# Altium project PLC_STM.PrjPcb
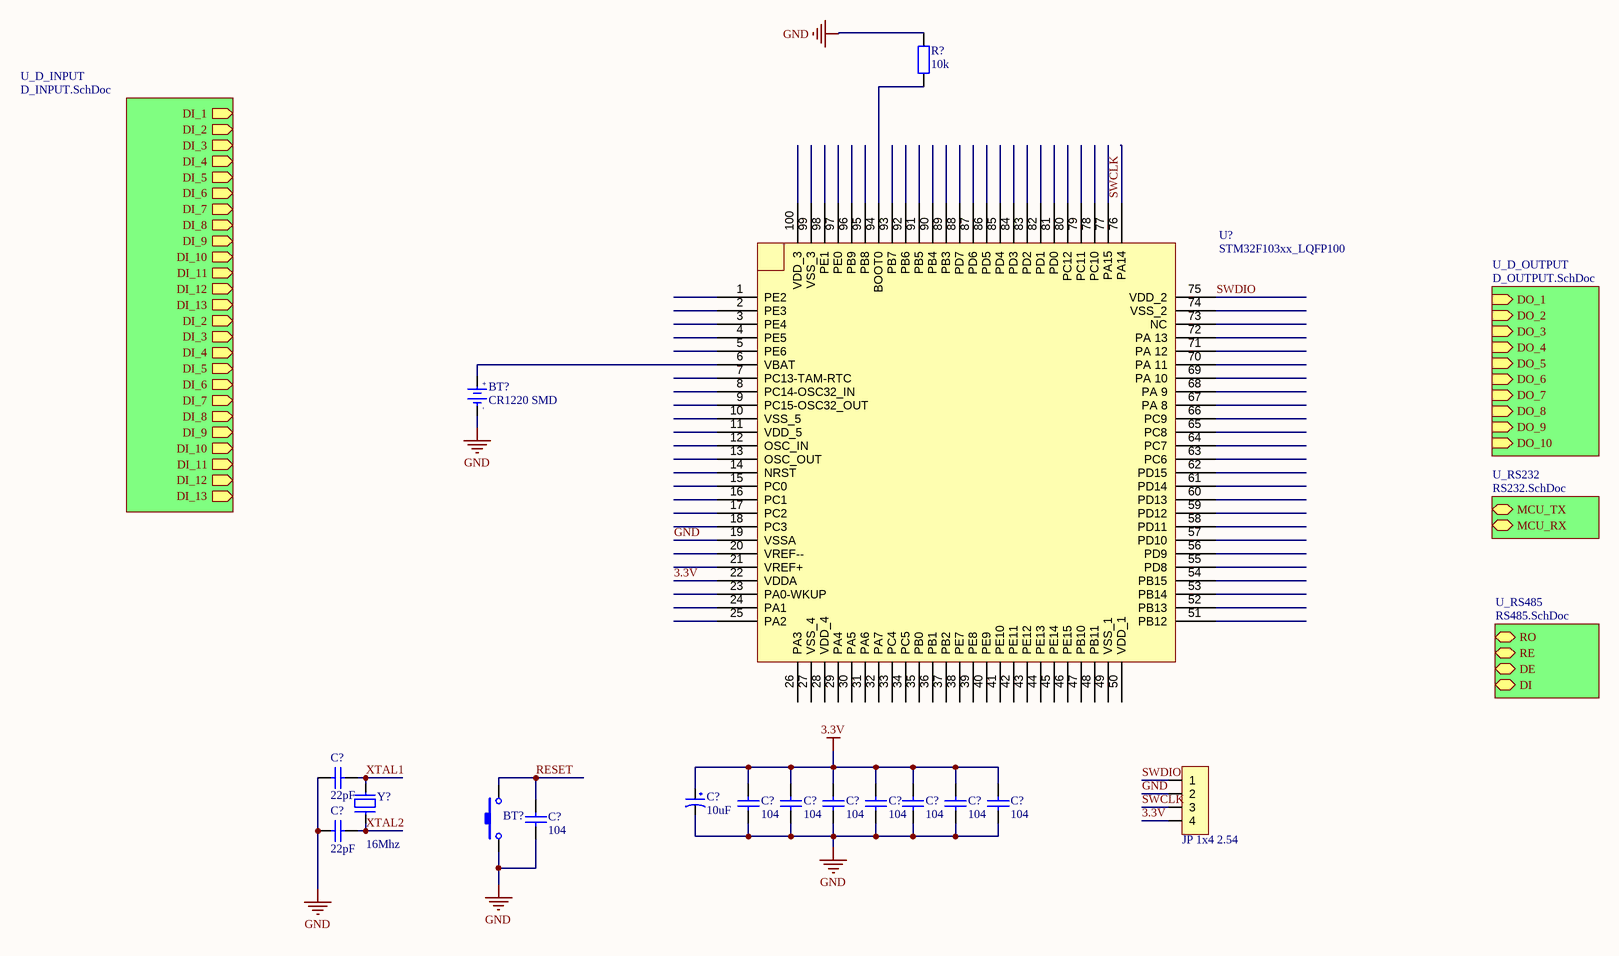
[diagram p0: PLC_STM_SCH.SchDoc]
5 sheets, 100 parts. Net scope: hierarchical (ports join the sheet entries above them; power ports are global).
Board file: PLC_STM_PCB.PcbDoc
Sheets:
  PLC_STM_SCH.SchDoc
    U_D_INPUT = D_INPUT.SchDoc
    U_D_OUTPUT = D_OUTPUT.SchDoc
  A_INPUT.SchDoc
  PWM_OUTPUT.SchDoc

## Sheet PLC_STM_SCH.SchDoc
size 420 x 297 mm; SheetNumber: 1; SheetTotal: 7

### Parts
(Parts that share a designator on the sheet are numbered #1, #2 ... from top to bottom, then left to right.)
BT?#1  CR1220 SMD  [DE PIN CR1220]
BT?#2  Nut Nhan 2 Chan SMD 3x6x2.5  [Nut Nhan 2 Chan SMD 3x6x2.5]  (value not drawn)
C?#1  22pF  [tu 0805]
C?#2  10uF  [tu tantalum smd3216]
C?#3  104  [tu 0805]
C?#4  104  [tu 0805]
C?#5  104  [tu 0805]
C?#6  104  [tu 0805]
C?#7  104  [tu 0805]
C?#8  104  [tu 0805]
C?#9  104  [tu 0805]
C?#10  104  [tu 0805]
C?#11  22pF  [tu 0805]
JP?  JP 1x4 2.54  [JP 1x4 DT]
R?#1  10k  [tro smd 0805]
U?#1  STM32F103xx_LQFP100  [STM32_LQFP100]
Y?  16Mhz  [Thach Anh 2 chan SMD]

### Sub-sheets
U_D_INPUT = D_INPUT.SchDoc: DI_1 (out), DI_2 (out), DI_3 (out), DI_4 (out), DI_5 (out), DI_6 (out), DI_7 (out), DI_8 (out), DI_9 (out), DI_10 (out), DI_11 (out), DI_12 (out), DI_13 (out), DI_2 (out), DI_3 (out), DI_4 (out), DI_5 (out), DI_6 (out), DI_7 (out), DI_8 (out), DI_9 (out), DI_10 (out), DI_11 (out), DI_12 (out), DI_13 (out)
U_D_OUTPUT = D_OUTPUT.SchDoc: DO_1 (in), DO_2 (in), DO_3 (in), DO_4 (in), DO_5 (in), DO_6 (in), DO_7 (in), DO_8 (in), DO_9 (in), DO_10 (in)
U_RS232 = RS232.SchDoc (file not in this document): MCU_TX (bidir), MCU_RX (bidir)
U_RS485 = RS485.SchDoc (file not in this document): RO (bidir), RE (bidir), DE (bidir), DI (bidir)

### Nets
3.3V: C?#2.1 C?#3.1 C?#4.1 C?#5.1 C?#6.1 C?#7.1 C?#8.1 C?#9.1 JP?.4 U?#1.22(VDDA)
GND: BT?#1.2(GND) BT?#2.1 C?#1.2 C?#2.2 C?#3.2 C?#4.2 C?#5.2 C?#6.2 C?#7.2 C?#8.2 C?#9.2 C?#10.2 C?#11.2 JP?.2 R?#1.2 U?#1.19(VSSA)
RESET: BT?#2.2 C?#10.1
SWCLK: JP?.3 U?#1.76(PA14)
SWDIO: JP?.1 U?#1.75(VDD_2)
XTAL1: C?#1.1 Y?.1
XTAL2: C?#11.1 Y?.2
NetBT?#1_1: BT?#1.1(+3V) U?#1.6(VBAT)
NetR?#1_1: R?#1.1 U?#1.94(BOOT0)
NetR?#3_1: sheet U_D_INPUT/DI_2, sheet U_D_INPUT/DI_2
NetR?#6_1: sheet U_D_INPUT/DI_3, sheet U_D_INPUT/DI_3
NetR?#7_1: sheet U_D_INPUT/DI_4, sheet U_D_INPUT/DI_4
NetR?#8_1: sheet U_D_INPUT/DI_10, sheet U_D_INPUT/DI_10
NetR?#12_1: sheet U_D_INPUT/DI_5, sheet U_D_INPUT/DI_5
NetR?#13_1: sheet U_D_INPUT/DI_6, sheet U_D_INPUT/DI_6
NetR?#14_1: sheet U_D_INPUT/DI_11, sheet U_D_INPUT/DI_11
NetR?#18_1: sheet U_D_INPUT/DI_7, sheet U_D_INPUT/DI_7
NetR?#19_1: sheet U_D_INPUT/DI_8, sheet U_D_INPUT/DI_8
NetR?#20_1: sheet U_D_INPUT/DI_12, sheet U_D_INPUT/DI_12
NetR?#24_1: sheet U_D_INPUT/DI_9, sheet U_D_INPUT/DI_9
NetR?#25_1: sheet U_D_INPUT/DI_13, sheet U_D_INPUT/DI_13

Not connected (* = marked no-connect by the designer): U?#1 1(PE2) 2(PE3) 3(PE4) 4(PE5) 5(PE6) 7(PC13-TAM-RTC) 8(PC14-OSC32_IN) 9(PC15-OSC32_OUT) 10(VSS_5) 11(VDD_5) 12(OSC_IN) 13(OSC_OUT) 14(NRST) 15(PC0) 16(PC1) 17(PC2) 18(PC3) 20(VREF--) 21(VREF+) 23(PA0-WKUP) 24(PA1) 25(PA2) 26(PA3) 27(VSS_4) 28(VDD_4) 29(PA4) 30(PA5) 31(PA6) 32(PA7) 33(PC4) 34(PC5) 35(PB0) 36(PB1) 37(PB2) 38(PE7) 39(PE8) 40(PE9) 41(PE10) 42(PE11) 43(PE12) 44(PE13) 45(PE14) 46(PE15) 47(PB10) 48(PB11) 49(VSS_1) 50(VDD_1) 51(PB12) 52(PB13) 53(PB14) 54(PB15) 55(PD8) 56(PD9) 57(PD10) 58(PD11) 59(PD12) 60(PD13) 61(PD14) 62(PD15) 63(PC6) 64(PC7) 65(PC8) 66(PC9) 67(PA_8) 68(PA_9) 69(PA_10) 70(PA_11) 71(PA_12) 72(PA_13) 73(NC) 74(VSS_2) 77(PA15) 78(PC10) 79(PC11) 80(PC12) 81(PD0) 82(PD1) 83(PD2) 84(PD3) 85(PD4) 86(PD5) 87(PD6) 88(PD7) 89(PB3) 90(PB4) 91(PB5) 92(PB6) 93(PB7) 95(PB8) 96(PB9) 97(PE0) 98(PE1) 99(VSS_3) 100(VDD_3)

### Notes on the sheet
- THIS DOCUMENT AND THE DATA DISCLOSED HEREIN OR
- HEREWITH IS THE PROPERTY OF ALTIUM LIMITED AND MAY
- DWG NO:
- REVISION
- REV:
- DESCRIPTION
- DATE
- APPROVED
- BE FREELY DISTRIBUTED IN WHOLE. NO RIGHTS ARE
- RESERVED OR EXPRESS OR IMPLIED WARANTEE GIVEN.
- ENG:
- APPROVALS
- PROJECT
- DSN:
- CHK:
- REFERENCE DOCUMENTS
- PROJECT REVISION:
- TITLE
- DOCUMENT REVISION:
- DESIGN ITEM:
- BOM:
- FAB DWG:
- PCB DWG:
- ASSY DWG:
- SCALE:
- A3
- SIZE
- CAGE CODE
- FILE NAME
- DWG NO.
- SHEET
- OF
- REV
- (in symbol De pin CR1220 SMD) +; -

### Library data of the parts
BT?#1 = De pin CR1220 SMD: Ten: Đế PIN CR1220 SMD; Ma_Hang: MH000833
BT?#2 = Nut Nhan 2 Chan SMD 3x6x2.5: Ma_Hang: MH001036; Ten: Nút Nhấn 2 Chân 3x6x2.5MM SMD
C?#1 C?#11 = Tu 0805 22pF 50V 10%: Dán; Don_Vi: Con; So_Chan: 2; Ten_Linh_Kien: Tụ 0805 22P 10% 50V; Ma_Hang: MH004560; Chung_Loai: Dán; Kieu_Chan: *
C?#2 = Tu tantalum 10uF 16V SMD3216: Dán; Don_Vi: Con; So_Chan: 2; Ten_Linh_Kien: Tụ tantalum 106C-10uF 16V SMD3216; Ma_Hang: MH001954; Chung_Loai: Dán; Kieu_Chan: *
C?#3-C?#10 = Tu 0805 104 50V 10%: Dán; Don_Vi: Con; So_Chan: 2; Ten_Linh_Kien: Tụ 0805 104-100nF 10% 50V; Ma_Hang: MH004551; Chung_Loai: Dán; Kieu_Chan: *
JP? = JP 1x4 2.54 Duc Thang: Cắm; Ten_Linh_Kien: Jump Đơn Đực 2.54MM 1x40P Thẳng 11MM; Don_Vi: Con; Ma_Hang: MH000903; Ghi_Chu: *; Kieu_Chan: *; Chung_Loai: Cắm
R?#1 = Tro 0805 5% 10k: Dán; Don_Vi: Con; So_Chan: 2; Ten_Linh_Kien: Trở 0805 5% 10k; Ma_Hang: MH005239; Chung_Loai: Dán; Kieu_Chan: *
Y? = Thach Anh 2 chan SMD: Crystal For all Crystal 2pin.; Value: 4Mhz

## Sheet D_INPUT.SchDoc
size A; SheetNumber: 2; SheetTotal: 5
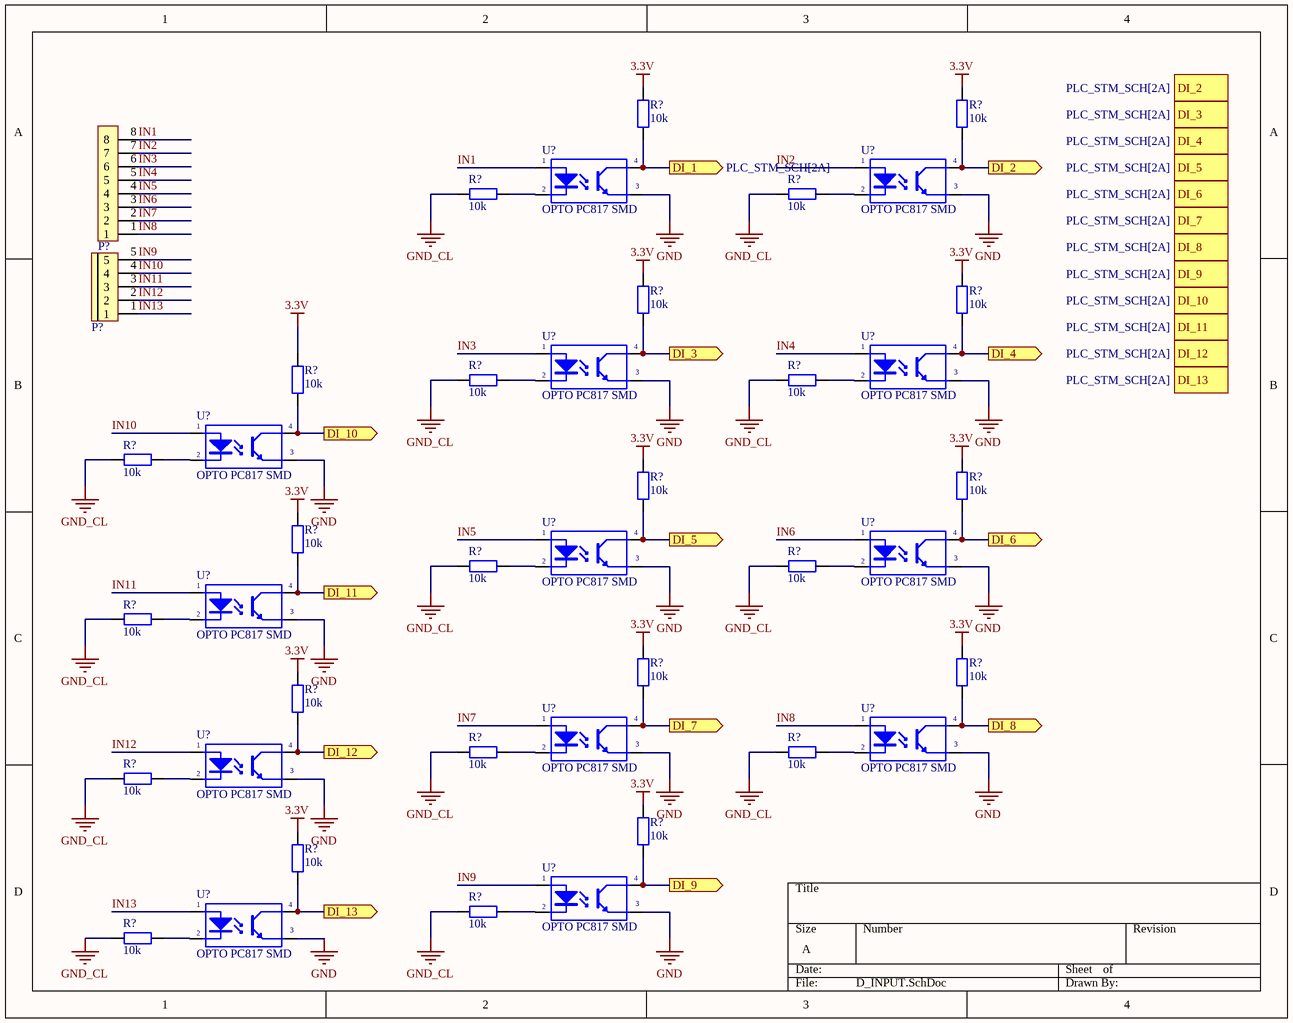
[diagram p1: D_INPUT.SchDoc]

### Parts
(Parts that share a designator on the sheet are numbered #1, #2 ... from top to bottom, then left to right.)
P?#1  CON 8 EDG5.08  [CON 8 8EDG5.08]  (value not drawn)
P?#2  CON 5 EDG5.08  [CON 5 5EDG5.08]  (value not drawn)
R?#2  10k  [tro smd 0805]
R?#3  10k  [tro smd 0805]
R?#4  10k  [tro smd 0805]
R?#5  10k  [tro smd 0805]
R?#6  10k  [tro smd 0805]
R?#7  10k  [tro smd 0805]
R?#8  10k  [tro smd 0805]
R?#9  10k  [tro smd 0805]
R?#10  10k  [tro smd 0805]
R?#11  10k  [tro smd 0805]
R?#12  10k  [tro smd 0805]
R?#13  10k  [tro smd 0805]
R?#14  10k  [tro smd 0805]
R?#15  10k  [tro smd 0805]
R?#16  10k  [tro smd 0805]
R?#17  10k  [tro smd 0805]
R?#18  10k  [tro smd 0805]
R?#19  10k  [tro smd 0805]
R?#20  10k  [tro smd 0805]
R?#21  10k  [tro smd 0805]
R?#22  10k  [tro smd 0805]
R?#23  10k  [tro smd 0805]
R?#24  10k  [tro smd 0805]
R?#25  10k  [tro smd 0805]
R?#26  10k  [tro smd 0805]
R?#27  10k  [tro smd 0805]
U?#2  OPTO PC817 SMD  [SOP4]
U?#3  OPTO PC817 SMD  [SOP4]
U?#4  OPTO PC817 SMD  [SOP4]
U?#5  OPTO PC817 SMD  [SOP4]
U?#6  OPTO PC817 SMD  [SOP4]
U?#7  OPTO PC817 SMD  [SOP4]
U?#8  OPTO PC817 SMD  [SOP4]
U?#9  OPTO PC817 SMD  [SOP4]
U?#10  OPTO PC817 SMD  [SOP4]
U?#11  OPTO PC817 SMD  [SOP4]
U?#12  OPTO PC817 SMD  [SOP4]
U?#13  OPTO PC817 SMD  [SOP4]
U?#14  OPTO PC817 SMD  [SOP4]

### Ports
DI_1 (out, see PLC_STM_SCH[2A]), DI_2 (out, see PLC_STM_SCH[2A]), DI_3 (out, see PLC_STM_SCH[2A]), DI_4 (out, see PLC_STM_SCH[2A]), DI_5 (out, see PLC_STM_SCH[2A]), DI_6 (out, see PLC_STM_SCH[2A]), DI_7 (out, see PLC_STM_SCH[2A]), DI_8 (out, see PLC_STM_SCH[2A]), DI_9 (out, see PLC_STM_SCH[2A]), DI_10 (out, see PLC_STM_SCH[2A]), DI_11 (out, see PLC_STM_SCH[2A]), DI_12 (out, see PLC_STM_SCH[2A]), DI_13 (out, see PLC_STM_SCH[2A])

### Nets
3.3V: R?#2.2 R?#3.2 R?#6.2 R?#7.2 R?#8.2 R?#12.2 R?#13.2 R?#14.2 R?#18.2 R?#19.2 R?#20.2 R?#24.2 R?#25.2
GND: U?#2.3(E) U?#3.3(E) U?#4.3(E) U?#5.3(E) U?#6.3(E) U?#7.3(E) U?#8.3(E) U?#9.3(E) U?#10.3(E) U?#11.3(E) U?#12.3(E) U?#13.3(E) U?#14.3(E)
GND_CL: R?#4.1 R?#5.1 R?#9.1 R?#10.1 R?#11.1 R?#15.1 R?#16.1 R?#17.1 R?#21.1 R?#22.1 R?#23.1 R?#26.1 R?#27.1
IN1: P?#1.8 U?#2.1(A)
IN2: P?#1.7 U?#3.1(A)
IN3: P?#1.6 U?#4.1(A)
IN4: P?#1.5 U?#5.1(A)
IN5: P?#1.4 U?#7.1(A)
IN6: P?#1.3 U?#8.1(A)
IN7: P?#1.2 U?#10.1(A)
IN8: P?#1.1 U?#11.1(A)
IN9: P?#2.5 U?#13.1(A)
IN10: P?#2.4 U?#6.1(A)
IN11: P?#2.3 U?#9.1(A)
IN12: P?#2.2 U?#12.1(A)
IN13: P?#2.1 U?#14.1(A)
NetR?#2_1: R?#2.1 U?#2.4(C) ; port DI_1
NetR?#3_1: R?#3.1 U?#3.4(C) ; port DI_2
NetR?#4_2: R?#4.2 U?#2.2(K)
NetR?#5_2: R?#5.2 U?#3.2(K)
NetR?#6_1: R?#6.1 U?#4.4(C) ; port DI_3
NetR?#7_1: R?#7.1 U?#5.4(C) ; port DI_4
NetR?#8_1: R?#8.1 U?#6.4(C) ; port DI_10
NetR?#9_2: R?#9.2 U?#4.2(K)
NetR?#10_2: R?#10.2 U?#5.2(K)
NetR?#11_2: R?#11.2 U?#6.2(K)
NetR?#12_1: R?#12.1 U?#7.4(C) ; port DI_5
NetR?#13_1: R?#13.1 U?#8.4(C) ; port DI_6
NetR?#14_1: R?#14.1 U?#9.4(C) ; port DI_11
NetR?#15_2: R?#15.2 U?#7.2(K)
NetR?#16_2: R?#16.2 U?#8.2(K)
NetR?#17_2: R?#17.2 U?#9.2(K)
NetR?#18_1: R?#18.1 U?#10.4(C) ; port DI_7
NetR?#19_1: R?#19.1 U?#11.4(C) ; port DI_8
NetR?#20_1: R?#20.1 U?#12.4(C) ; port DI_12
NetR?#21_2: R?#21.2 U?#10.2(K)
NetR?#22_2: R?#22.2 U?#11.2(K)
NetR?#23_2: R?#23.2 U?#12.2(K)
NetR?#24_1: R?#24.1 U?#13.4(C) ; port DI_9
NetR?#25_1: R?#25.1 U?#14.4(C) ; port DI_13
NetR?#26_2: R?#26.2 U?#13.2(K)
NetR?#27_2: R?#27.2 U?#14.2(K)

### Library data of the parts
P?#1 = CON 8 EDG5.08: Cắm; Ten_Linh_Kien: CON 8 2EDG5.08-8P 5.08MM ( Xanh Cong); Ma_Hang: MH000978; Don_Vi: Con; Ghi_Chu: *; Kieu_Chan: *; Chung_Loai: Cắm
P?#2 = CON 5 EDG5.08: Cắm; Ten_Linh_Kien: CON 5 2EDG5.08-5P 5.08MM ( Xanh Cong); Ma_Hang: MH003589; Kieu_Chan: *; Don_Vi: Con; Ghi_Chu: *; Chung_Loai: Cắm
R?#2-R?#27 = Tro 0805 5% 10k: as R?#1 on sheet PLC_STM_SCH; Chung_Loai: Dán; Kieu_Chan: *
U?#2-U?#14 = OPTO PC817 SMD: Single Opto; Value: PC817

## Sheet D_OUTPUT.SchDoc
size A; SheetNumber: 2; SheetTotal: 5
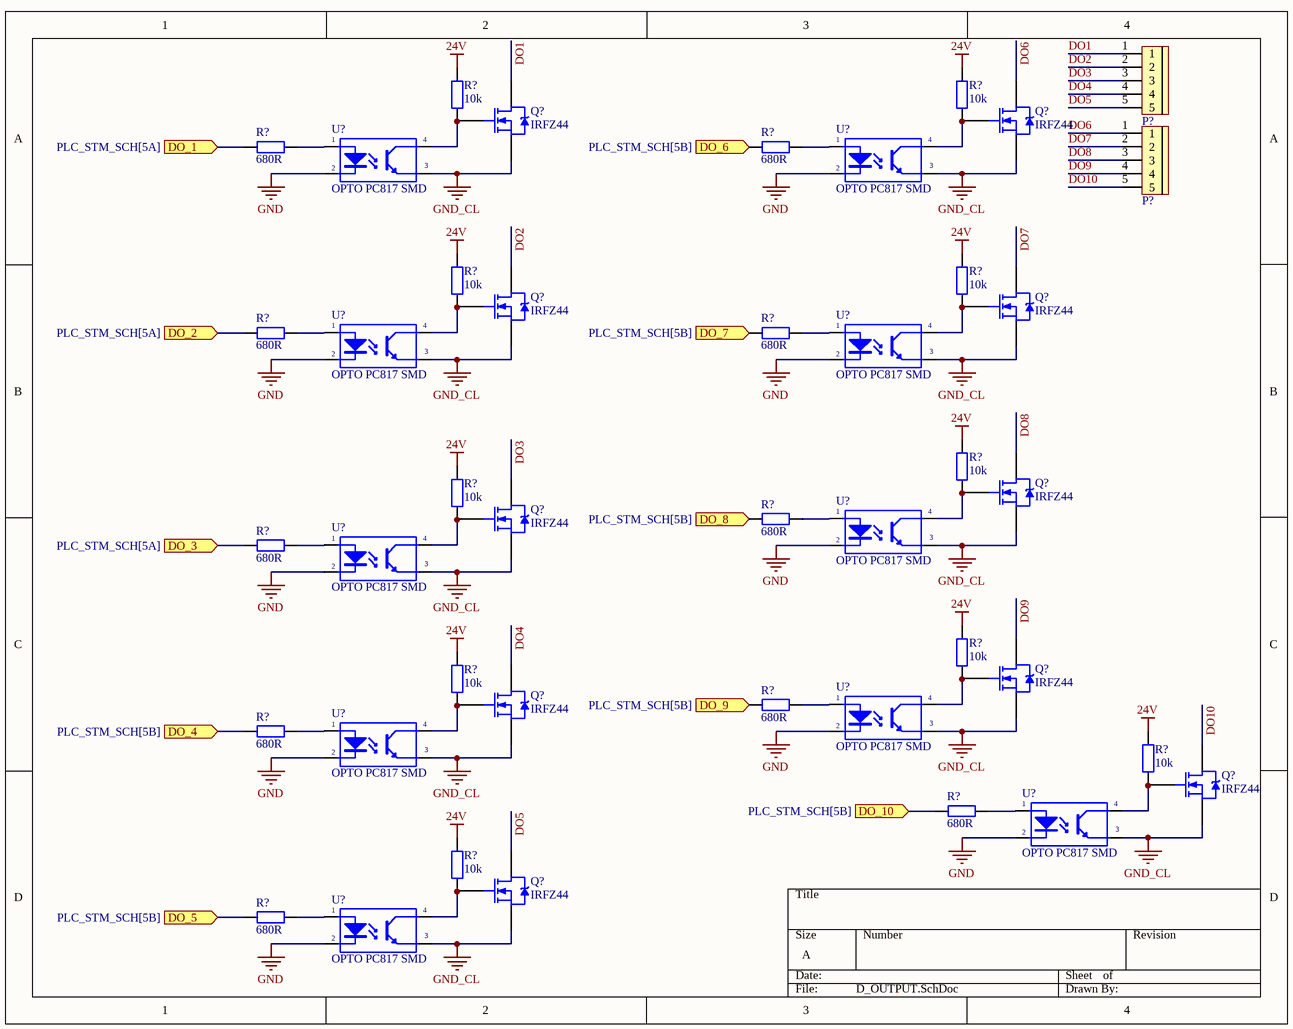
[diagram p2: D_OUTPUT.SchDoc]

### Parts
(Parts that share a designator on the sheet are numbered #1, #2 ... from top to bottom, then left to right.)
P?#3  CON 5 EDG5.08  [CON 5 5EDG5.08]  (value not drawn)
P?#4  CON 5 EDG5.08  [CON 5 5EDG5.08]  (value not drawn)
Q?#1  IRFZ44  [TO220]
Q?#2  IRFZ44  [TO220]
Q?#3  IRFZ44  [TO220]
Q?#4  IRFZ44  [TO220]
Q?#5  IRFZ44  [TO220]
Q?#6  IRFZ44  [TO220]
Q?#7  IRFZ44  [TO220]
Q?#8  IRFZ44  [TO220]
Q?#9  IRFZ44  [TO220]
Q?#10  IRFZ44  [TO220]
R?#28  10k  [tro smd 0805]
R?#29  10k  [tro smd 0805]
R?#30  680R  [Tro SMD 0805]
R?#31  680R  [Tro SMD 0805]
R?#32  10k  [tro smd 0805]
R?#33  10k  [tro smd 0805]
R?#34  680R  [Tro SMD 0805]
R?#35  680R  [Tro SMD 0805]
R?#36  10k  [tro smd 0805]
R?#37  10k  [tro smd 0805]
R?#38  680R  [Tro SMD 0805]
R?#39  680R  [Tro SMD 0805]
R?#40  10k  [tro smd 0805]
R?#41  10k  [tro smd 0805]
R?#42  680R  [Tro SMD 0805]
R?#43  680R  [Tro SMD 0805]
R?#44  10k  [tro smd 0805]
R?#45  680R  [Tro SMD 0805]
R?#46  10k  [tro smd 0805]
R?#47  680R  [Tro SMD 0805]
U?#15  OPTO PC817 SMD  [SOP4]
U?#16  OPTO PC817 SMD  [SOP4]
U?#17  OPTO PC817 SMD  [SOP4]
U?#18  OPTO PC817 SMD  [SOP4]
U?#19  OPTO PC817 SMD  [SOP4]
U?#20  OPTO PC817 SMD  [SOP4]
U?#21  OPTO PC817 SMD  [SOP4]
U?#22  OPTO PC817 SMD  [SOP4]
U?#23  OPTO PC817 SMD  [SOP4]
U?#24  OPTO PC817 SMD  [SOP4]

### Ports
DO_1 (in, see PLC_STM_SCH[5A]), DO_2 (in, see PLC_STM_SCH[5A]), DO_3 (in, see PLC_STM_SCH[5A]), DO_4 (in, see PLC_STM_SCH[5B]), DO_5 (in, see PLC_STM_SCH[5B]), DO_6 (in, see PLC_STM_SCH[5B]), DO_7 (in, see PLC_STM_SCH[5B]), DO_8 (in, see PLC_STM_SCH[5B]), DO_9 (in, see PLC_STM_SCH[5B]), DO_10 (in, see PLC_STM_SCH[5B])

### Nets
24V: R?#28.2 R?#29.2 R?#32.2 R?#33.2 R?#36.2 R?#37.2 R?#40.2 R?#41.2 R?#44.2 R?#46.2
GND: U?#15.2(K) U?#16.2(K) U?#17.2(K) U?#18.2(K) U?#19.2(K) U?#20.2(K) U?#21.2(K) U?#22.2(K) U?#23.2(K) U?#24.2(K)
GND_CL: Q?#1.3(S) Q?#2.3(S) Q?#3.3(S) Q?#4.3(S) Q?#5.3(S) Q?#6.3(S) Q?#7.3(S) Q?#8.3(S) Q?#9.3(S) Q?#10.3(S) U?#15.3(E) U?#16.3(E) U?#17.3(E) U?#18.3(E) U?#19.3(E) U?#20.3(E) U?#21.3(E) U?#22.3(E) U?#23.3(E) U?#24.3(E)
DO1: P?#3.1 Q?#1.2(D)
DO2: P?#3.2 Q?#3.2(D)
DO3: P?#3.3 Q?#6.2(D)
DO4: P?#3.4 Q?#8.2(D)
DO5: P?#3.5 Q?#10.2(D)
DO6: P?#4.1 Q?#2.2(D)
DO7: P?#4.2 Q?#4.2(D)
DO8: P?#4.3 Q?#5.2(D)
DO9: P?#4.4 Q?#7.2(D)
DO10: P?#4.5 Q?#9.2(D)
NetQ?#1_1: Q?#1.1(G) R?#28.1 U?#15.4(C)
NetQ?#2_1: Q?#2.1(G) R?#29.1 U?#16.4(C)
NetQ?#3_1: Q?#3.1(G) R?#32.1 U?#17.4(C)
NetQ?#4_1: Q?#4.1(G) R?#33.1 U?#18.4(C)
NetQ?#5_1: Q?#5.1(G) R?#36.1 U?#19.4(C)
NetQ?#6_1: Q?#6.1(G) R?#37.1 U?#20.4(C)
NetQ?#7_1: Q?#7.1(G) R?#40.1 U?#21.4(C)
NetQ?#8_1: Q?#8.1(G) R?#41.1 U?#22.4(C)
NetQ?#9_1: Q?#9.1(G) R?#44.1 U?#23.4(C)
NetQ?#10_1: Q?#10.1(G) R?#46.1 U?#24.4(C)
NetR?#30_1: R?#30.1 ; port DO_1
NetR?#30_2: R?#30.2 U?#15.1(A)
NetR?#31_1: R?#31.1 ; port DO_6
NetR?#31_2: R?#31.2 U?#16.1(A)
NetR?#34_1: R?#34.1 ; port DO_2
NetR?#34_2: R?#34.2 U?#17.1(A)
NetR?#35_1: R?#35.1 ; port DO_7
NetR?#35_2: R?#35.2 U?#18.1(A)
NetR?#38_1: R?#38.1 ; port DO_8
NetR?#38_2: R?#38.2 U?#19.1(A)
NetR?#39_1: R?#39.1 ; port DO_3
NetR?#39_2: R?#39.2 U?#20.1(A)
NetR?#42_1: R?#42.1 ; port DO_9
NetR?#42_2: R?#42.2 U?#21.1(A)
NetR?#43_1: R?#43.1 ; port DO_4
NetR?#43_2: R?#43.2 U?#22.1(A)
NetR?#45_1: R?#45.1 ; port DO_10
NetR?#45_2: R?#45.2 U?#23.1(A)
NetR?#47_1: R?#47.1 ; port DO_5
NetR?#47_2: R?#47.2 U?#24.1(A)

### Library data of the parts
P?#3 P?#4 = CON 5 EDG5.08: as P?#2 on sheet D_INPUT; Kieu_Chan: *; Don_Vi: Con; Ghi_Chu: *; Chung_Loai: Cắm
Q?#1-Q?#10 = IRFZ44 DIP: N-Channel Power MOSFET
R?#28 R?#29 R?#32 R?#33 R?#36 R?#37 R?#40 R?#41 R?#44 R?#46 = Tro 0805 5% 10k: as R?#1 on sheet PLC_STM_SCH; Chung_Loai: Dán; Kieu_Chan: *
R?#30 R?#31 R?#34 R?#35 R?#38 R?#39 R?#42 R?#43 R?#45 R?#47 = Tro 0805 5% 680R: Dán; Don_Vi: Con; Ma_Hang: MH005344; So_Chan: 2; Ten_Linh_Kien: Trở 0805 5% 680R; Chung_Loai: Dán; Kieu_Chan: *
U?#15-U?#24 = OPTO PC817 SMD: Single Opto; Value: PC817

## Sheet A_INPUT.SchDoc
size A; SheetNumber: 4; SheetTotal: 5

## Sheet PWM_OUTPUT.SchDoc
size A; SheetNumber: 5; SheetTotal: 5

## Nets that join several sheets
3.3V: PLC_STM_SCH (10 pins), D_INPUT (13 pins)
GND: PLC_STM_SCH (16 pins), D_INPUT (13 pins), D_OUTPUT (10 pins)
GND_CL: D_INPUT (13 pins), D_OUTPUT (20 pins)